# EAGLE design ProjectorController (EAGLE 9.6.1)
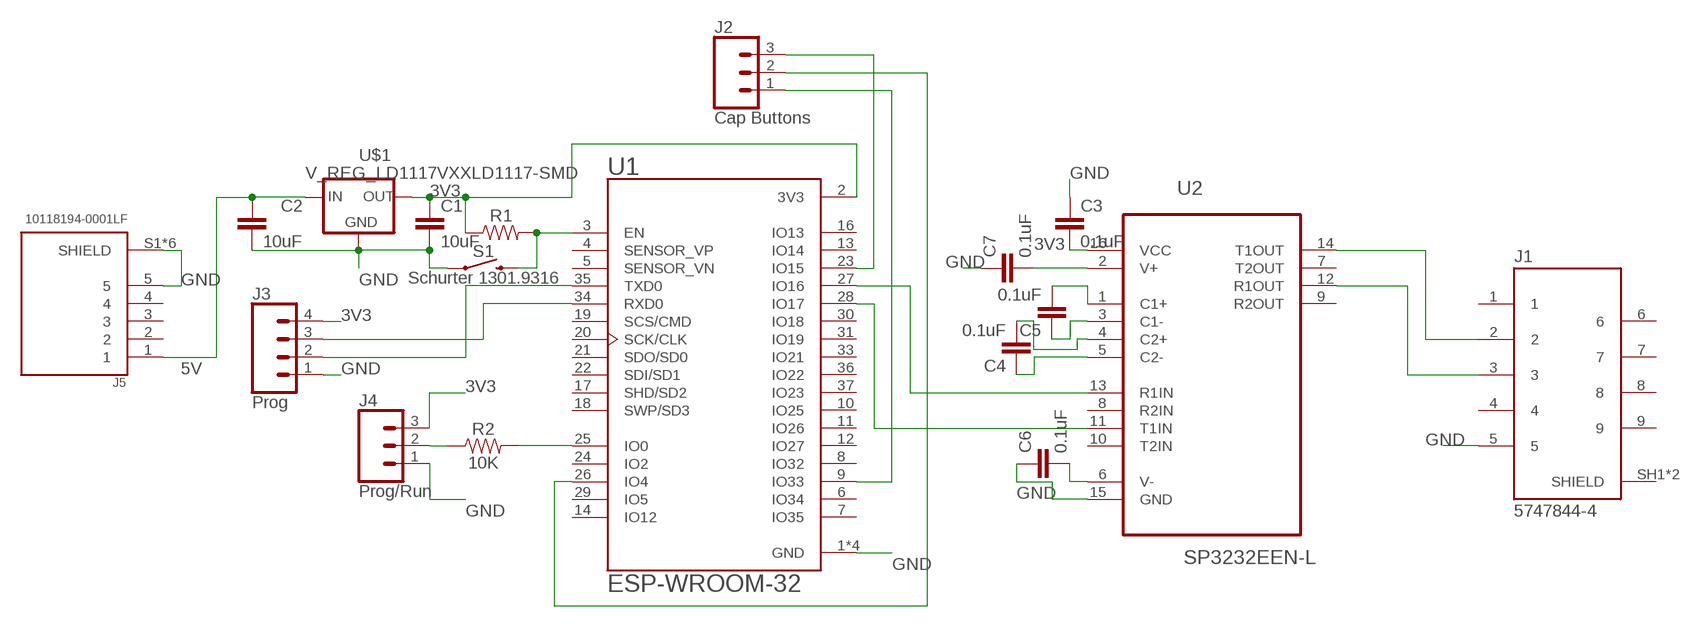
[diagram p0: schematic, sheet 1]

## Parts
C1  10uF  CAP-1206  [1206]
C2  10uF  CAP-1206  [1206]
C3  0.1uF  CAP-1206  [1206]
C4  0.1uF  CAP-1206  [1206]
C5  0.1uF  CAP-1206  [1206]
C6  0.1uF  CAP-1206  [1206]
C7  0.1uF  CAP-1206  [1206]
J1  5747844-4  [TE_5747844-4]
J2  Cap Buttons  CONN_03SCREW-NS  [SCREWTERMINAL-3.5MM-3-NS]
J3  Prog  CONN_04PTH  [1X04]
J4  Prog/Run  CONN_03  [1X03]
J5  10118194-0001LF  [AMPHENOL_10118194-0001LF]
R1  RESISTOR1206  [1206]
R2  10K  RESISTOR1206  [1206]
S1  Schurter 1301.9316  MOMENTARY-SWITCH-SPST-SMD-6.2MM-TALL  [TACTILE_SWITCH_SMD_6.2MM_TALL]
U1  ESP-WROOM-32  [MODULE_ESP-WROOM-32]
U2  SP3232EEN-L  [SOIC127P600X175-16N]
U$1  V_REG_LD1117VXXLD1117-SMD  [SOT223]

## Nets
3V3: C1.1 C3.2 J3.4 J4.3 R1.1 U1.2(3V3) U2.16(VCC) U$1.2(OUT)
5V: C2.1 J5.1 U$1.3(IN)
GND: C1.2 C2.2 C3.1 C6.1 C7.1 J1.5 J3.1 J4.1 J5.5 J5.S1(SHIELD) J5.S2(SHIELD) J5.S3(SHIELD) J5.S4(SHIELD) J5.S5(SHIELD) J5.S6(SHIELD) S1.A2 U1.1(GND) U1.1.1(GND) U1.15(GND) U1.38(GND) U2.15(GND) U$1.1(GND)
N$1: J2.3 U1.23(IO15)
N$2: J2.1 U1.9(IO33)
N$3: J2.2 U1.26(IO4)
N$4: R1.2 S1.B2 U1.3(EN)
N$5: R2.2 U1.25(IO0)
N$6: J4.2 R2.1
N$7: J3.2 U1.35(TXD0)
N$8: J3.3 U1.34(RXD0)
N$9: U1.28(IO17) U2.11(T1IN)
N$10: J1.2 U2.14(T1OUT)
N$11: J1.3 U2.12(R1OUT)
N$12: C5.2 U2.1(C1+)
N$13: U1.27(IO16) U2.13(R1IN)
N$14: C5.1 U2.3(C1-)
N$15: C4.2 U2.4(C2+)
N$16: C4.1 U2.5(C2-)
N$17: C7.2 U2.2(V+)
N$19: C6.2 U2.6(V-)
Unconnected: J1.1 J1.4 J1.6 J1.7 J1.8 J1.9 J1.SH1(SHIELD) J1.SH2(SHIELD) J5.2 J5.3 J5.4 U1.4(SENSOR_VP) U1.5(SENSOR_VN) U1.6(IO34) U1.7(IO35) U1.8(IO32) U1.10(IO25) U1.11(IO26) U1.12(IO27) U1.13(IO14) U1.14(IO12) U1.16(IO13) U1.17(SHD/SD2) U1.18(SWP/SD3) U1.19(SCS/CMD) U1.20(SCK/CLK) U1.21(SDO/SD0) U1.22(SDI/SD1) U1.24(IO2) U1.29(IO5) U1.30(IO18) U1.31(IO19) U1.33(IO21) U1.36(IO22) U1.37(IO23) U2.7(T2OUT) U2.8(R2IN) U2.9(R2OUT) U2.10(T2IN)

## Library data of the parts
C1-C7 = SparkFun-Capacitors:CAP
J1 = 5747844-4:5747844-4: CONN D-SUB RCPT 9POS R/A SOLDER; AVAILABILITY: Unavailable; CENTERLINE_PITCH: 2.74 mm[.108 in]; COMMENT: 5747844-4; DESCRIPTION: Connector D-Subminiature Receptacle 9 Position 2.74mm Solder Right Angle Through Hole 9 Terminal 1 Port Tray; EU_ROHS_COMPLIANCE: Compliant; MF: TE Connectivity; MP: 5747844-4; NUMBER_OF_POSITIONS: 9; PACKAGE: None; PRICE: None; PRODUCT_TYPE: Connector; TE_PURCHASE_URL: https://www.te.com/usa-en/product-5747844-4.html?te_bu=Cor&te_type=disp&te_campaign=seda_glo_cor-seda-global-disp-prtnr-fy19-seda-model-bom-cta_sma-317_1&elqCampaignId=32493
J2 = SparkFun-Connectors:CONN_03: Multi connection point. Often used as Generic Header-pin footprint for 0.1 inch spaced/style header connections On any of the 0.1 inch spaced packages, you can populate with these: Break Away Headers - Straight <https://www.sparkfun.com/products/116> (PRT-00116) Break Away Male Headers - Right Angle <https://www.sparkfun.com/products/553> (PRT-00553) Female Headers <https://www.sparkfun.com/products/115> (PRT-00115) Break Away Headers - Machine Pin <https://www.sparkfun.com/products/117> (PRT-00117) Break Away Female Headers - Swiss Machine Pin <https://www.sparkfun.com/products/743> (PRT-00743) Stackable Header - 3 Pin (Female, 0.1") <https://www.sparkfun.com/products/13875> (PRT-13875) For SCREWTERMINALS and SPRING TERMINALS visit here: Screw Terimnals on SparkFun.com <https://www.sparkfun.com/search/results?term=Screw+Terminals> (5mm/3.5mm/2.54mm spacing) This device is also useful as a general connection point to wire up your design to another part of your project. Our various solder wires solder well into these plated through hole pads. Hook-Up Wire - Assortment (Stranded, 22 AWG) <https://www.sparkfun.com/products/11375> (PRT-11375) Hook-Up Wire - Assortment (Solid Core, 22 AWG) <https://www.sparkfun.com/products/11367> (PRT-11367) View the entire wire category on our website here <https://www.sparkfun.com/categories/141> Special notes: Molex polarized connector foot print use with SKU : PRT-08232 with associated crimp pins and housings.
J3 = SparkFun-Connectors:CONN_04: Multi connection point. Often used as Generic Header-pin footprint for 0.1 inch spaced/style header connections On any of the 0.1 inch spaced packages, you can populate with these: Break Away Headers - Straight <https://www.sparkfun.com/products/116> (PRT-00116) Break Away Male Headers - Right Angle <https://www.sparkfun.com/products/553> (PRT-00553) Female Headers <https://www.sparkfun.com/products/115> (PRT-00115) Break Away Headers - Machine Pin <https://www.sparkfun.com/products/117> (PRT-00117) Break Away Female Headers - Swiss Machine Pin <https://www.sparkfun.com/products/743> (PRT-00743) For SCREWTERMINALS and SPRING TERMINALS visit here: Screw Terimnals on SparkFun.com <https://www.sparkfun.com/search/results?term=Screw+Terminals> (5mm/3.5mm/2.54mm spacing) This device is also useful as a general connection point to wire up your design to another part of your project. Our various solder wires solder well into these plated through hole pads. Hook-Up Wire - Assortment (Stranded, 22 AWG) <https://www.sparkfun.com/products/11375> (PRT-11375) Hook-Up Wire - Assortment (Solid Core, 22 AWG) <https://www.sparkfun.com/products/11367> (PRT-11367) View the entire wire category on our website here <https://www.sparkfun.com/categories/141> Special notes: Molex polarized connector foot print use with SKU : PRT-08231 with associated crimp pins and housings. 1MM SMD Version SKU: PRT-10208; PROD_ID: CONN-09696
J4 = SparkFun-Connectors:CONN_03: Multi connection point. Often used as Generic Header-pin footprint for 0.1 inch spaced/style header connections On any of the 0.1 inch spaced packages, you can populate with these: Break Away Headers - Straight <https://www.sparkfun.com/products/116> (PRT-00116) Break Away Male Headers - Right Angle <https://www.sparkfun.com/products/553> (PRT-00553) Female Headers <https://www.sparkfun.com/products/115> (PRT-00115) Break Away Headers - Machine Pin <https://www.sparkfun.com/products/117> (PRT-00117) Break Away Female Headers - Swiss Machine Pin <https://www.sparkfun.com/products/743> (PRT-00743) Stackable Header - 3 Pin (Female, 0.1") <https://www.sparkfun.com/products/13875> (PRT-13875) For SCREWTERMINALS and SPRING TERMINALS visit here: Screw Terimnals on SparkFun.com <https://www.sparkfun.com/search/results?term=Screw+Terminals> (5mm/3.5mm/2.54mm spacing) This device is also useful as a general connection point to wire up your design to another part of your project. Our various solder wires solder well into these plated through hole pads. Hook-Up Wire - Assortment (Stranded, 22 AWG) <https://www.sparkfun.com/products/11375> (PRT-11375) Hook-Up Wire - Assortment (Solid Core, 22 AWG) <https://www.sparkfun.com/products/11367> (PRT-11367) View the entire wire category on our website here <https://www.sparkfun.com/categories/141> Special notes: Molex polarized connector foot print use with SKU : PRT-08232 with associated crimp pins and housings.; PROD_ID: XXX-00000; VALUE: 455-1750-1-ND
J5 = 10118194-0001LF:10118194-0001LF: Micro Usb, 2.0 Type b, Rcpt, Smt; AVAILABILITY: Unavailable; DESCRIPTION: USB - micro B USB 2.0 Receptacle Connector 5 Position Surface Mount, Right Angle; Through Hole; MF: Amphenol ICC; MP: 10118194-0001LF; PACKAGE: None; PRICE: None
R1 R2 = SparkFun-Resistors:RESISTOR: Generic Resistor Package
S1 = SparkFun-Switches:MOMENTARY-SWITCH-SPST: Momentary Switch (Pushbutton) - SPST Normally-open (NO) SPST momentary switches (buttons, pushbuttons). Variants PTH-12MM - 12mm square, through-hole Momentary Pushbutton Switch - 12mm Square <https://www.sparkfun.com/products/9190> (COM-09190) PTH-6.0MM, PTH-6.0MM-KIT - 6.0mm square, through-hole Mini Pushbutton Switch <https://www.sparkfun.com/products/97> (COM-00097) KIT package intended for soldering kit's - only one side of pads' copper is exposed. PTH-RIGHT-ANGLE-KIT - Right-angle, through-hole Right Angle Tactile Button <https://www.sparkfun.com/products/10791> - Used on SparkFun BigTime Watch Kit <https://www.sparkfun.com/products/11734> SMD-12MM - 12mm square, surface-mount Tactile Button - SMD (12mm) <https://www.sparkfun.com/products/12993> (COM-12993) Used on SparkFun PicoBoard <https://www.sparkfun.com/products/11888> SMD-4.5MM - 4.5mm Square Trackball Switch Used on SparkFun Blackberry Trackballer Breakout <https://www.sparkfun.com/products/13169> SMD-4.6MMX2.8MM - 4.60mm x 2.80mm, surface mount Used on SparkFun SAMD21 Mini Breakout <https://www.sparkfun.com/products/13664> SMD-5.2MM, SMD-5.2-REDUNDANT - 5.2mm square, surface-mount Mini Pushbutton Switch - SMD <https://www.sparkfun.com/products/8720> (COM-08720) Used on Arduino Pro Mini <https://www.sparkfun.com/products/11114> REDUNDANT package connects both switch circuits together SMD-6.0X3.5MM - 6.0 x 3.5mm, surface mount Momentary Reset Switch SMD <https://www.sparkfun.com/products/8229> (COM-08229) SMD-6.2MM-TALL - 6.2mm square, surface mount Tactile Button - SMD (6mm) <https://www.sparkfun.com/products/12992> Used on SparkFun Digital Sandbox <https://www.sparkfun.com/products/12651> SMD-RIGHT-ANGLE - Right-angle, surface mount Used on SparkFun Block for Intel® Edison - Arduino <https://www.sparkfun.com/products/13036>; PROD_ID: SWCH-11966; SF_SKU: COM-12992
U1 = ESP-WROOM-32:ESP-WROOM-32: Module: combo; GPIO, I2C x2, I2S x2, SDIO, SPI x3, UART x3; 19.5dBm; AVAILABILITY: Unavailable; DESCRIPTION: WiFi 802.11b/g/n/d/e/i Transceiver Module 2.4GHz Surface Mount; MF: Olimex LTD; MP: ESP-WROOM-32; PACKAGE: Module Olimex LTD; PRICE: None
U2 = SP3232EEN-L:SP3232EEN-L: RS-232 Transceivers; AVAILABILITY: Unavailable; DESCRIPTION: SP3232E Series 120 kbps 5.5 V True RS-232 Transceiver - NSOIC-16; MF: MaxLinear, Inc.; MP: SP3232EEN-L/TR; PACKAGE: SOIC-16 Exar; PRICE: None
U$1 = SparkFun-IC-Power:V_REG_LD1117VXX: LD1117VXX voltage regulator. We carry the 3.3V version (COM-00526) in TO-220 package.; PROD_ID: VREG-13917

## Board
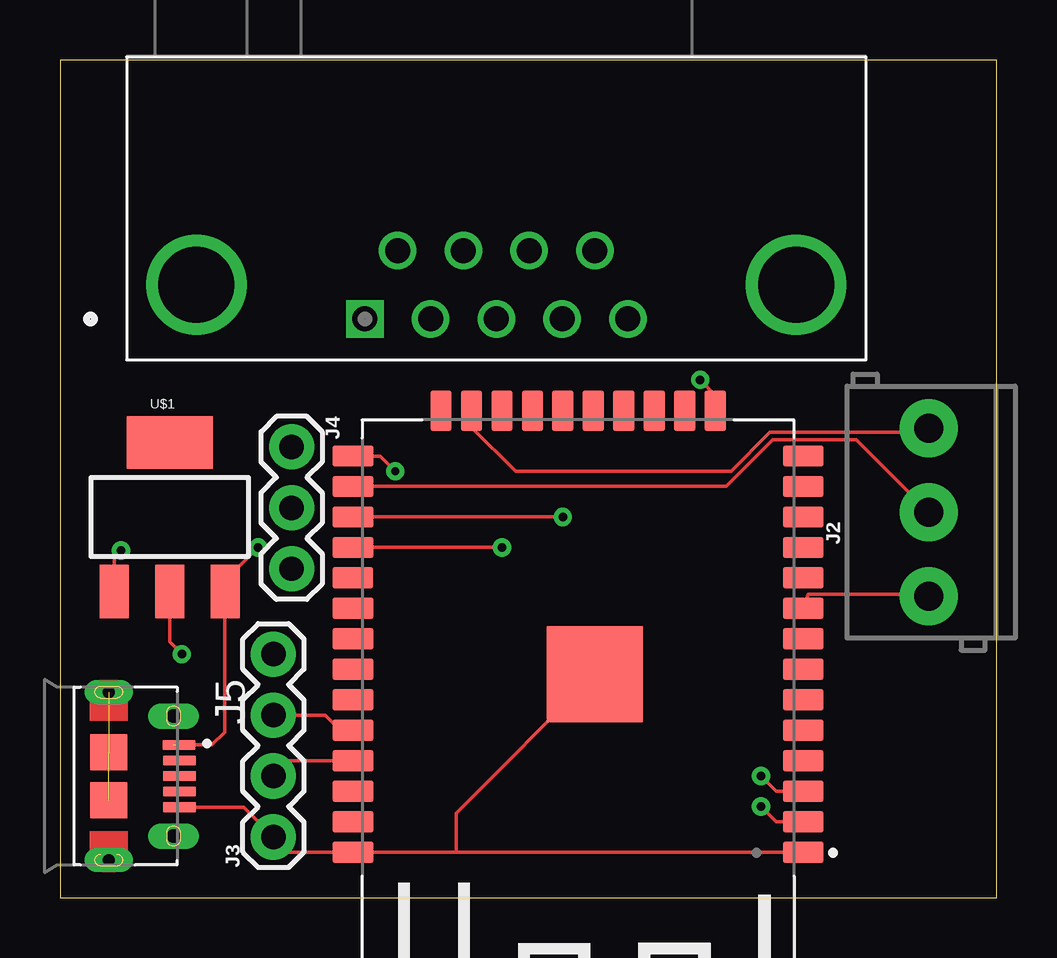
[diagram p1: board, top side]
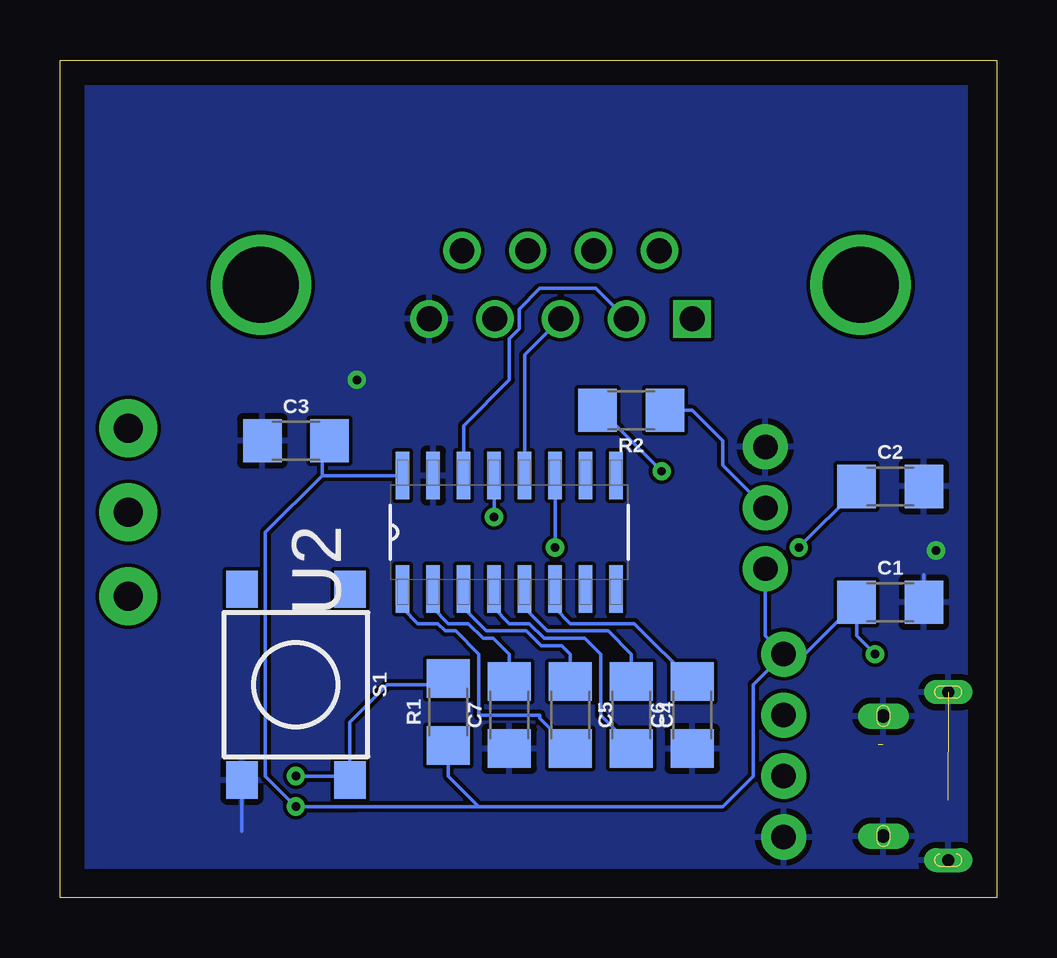
[diagram p2: board, bottom side, seen from below]

Size 39.04 x 34.91 mm. Coordinates in mm from the lower left corner, seen from the top.
Outline: 0,0 39.04,0 39.04,34.91 0,34.91 0,0
Copper layers (1*16): Top 0.035mm / dielectric 1.5mm / Bottom 0.035mm
Design rules "default": minimum track width 6mil, minimum drill 0.35mm, track to track 6mil, track to pad 6mil, pad to pad 6mil, via to via 6mil, smd to smd 6mil, copper to edge 40mil, drill to drill 6mil, minimum pad ring 10mil, minimum via ring 8mil, stop-mask expansion 4mil, vias tented up to drill 0mil, thermal gap 10mil

### Footprints (pad centres in the part's own frame; a part is rotated, then mirrored left to right if it is on the bottom)
1206 = smd 1.6 x 1.8: 1 -1.4,0; 2 1.4,0
TE_5747844-4 = drill 1.04 square: 1 0,0 | drill 1.04: 2 2.74,0; 3 5.48,0; 4 8.22,0; 5 10.96,0; 6 1.37,2.84; 7 4.11,2.84; 8 6.85,2.84; 9 9.59,2.84 | drill 3.17: SH1 -7.02,1.42; SH2 17.97,1.42
SCREWTERMINAL-3.5MM-3-NS = drill 1.2 pad 2.413: 1 0,0; 2 3.5,0; 3 7,0
1X04 = drill 1.016 pad 1.88: 1 0,0; 2 2.54,0; 3 5.08,0; 4 7.62,0
1X03 = drill 1.016 pad 1.88: 1 0,0; 2 2.54,0; 3 5.08,0
AMPHENOL_10118194-0001LF = smd 0.4 x 1.35: 1 -1.3,2.921; 2 -0.65,2.954; 3 0,2.954; 4 0.65,2.954; 5 1.3,2.954 | drill 0.55 pad 0.65 long: S1 -2.5,2.7; S2 2.5,2.7 | drill 0.5 pad 0.775 long: S3 -3.5,0; S6 3.5,0 | smd 1.5 x 1.55: S4 -1,0; S5 1,0
TACTILE_SWITCH_SMD_6.2MM_TALL = smd 1.55 x 1.3: A1 -3.975,-2.25; A2 3.975,-2.25; B1 -3.975,2.25; B2 3.975,2.25
MODULE_ESP-WROOM-32 = smd 1.7 x 0.9: 1 -9.381,8.255; 2 -9.381,6.985; 3 -9.381,5.715; 4 -9.381,4.445; 5 -9.381,3.175; 6 -9.381,1.905; 7 -9.381,0.635; 8 -9.381,-0.635; 9 -9.381,-1.905; 10 -9.381,-3.175; 11 -9.381,-4.445; 12 -9.381,-5.715; 13 -9.381,-6.985; 14 -9.381,-8.255; 25 9.381,-8.255; 26 9.381,-6.985; 27 9.381,-5.715; 28 9.381,-4.445; 29 9.398,-3.175; 30 9.381,-1.905; 31 9.381,-0.635; 32 9.381,0.635; 33 9.381,1.905; 34 9.381,3.175; 35 9.381,4.445; 36 9.381,5.715; 37 9.381,6.985; 38 9.381,8.255 | smd 4 x 4: 1.1 -0.7,0.845 | smd 0.9 x 1.7: 15 -5.715,-10.136; 16 -4.445,-10.136; 17 -3.175,-10.136; 18 -1.905,-10.136; 19 -0.635,-10.136; 20 0.635,-10.136; 21 1.905,-10.136; 22 3.175,-10.136; 23 4.445,-10.136; 24 5.715,-10.136
SOIC127P600X175-16N = smd 1.981 x 0.559: 1 -2.362,4.445; 2 -2.362,3.175; 3 -2.362,1.905; 4 -2.362,0.635; 5 -2.362,-0.635; 6 -2.362,-1.905; 7 -2.362,-3.175; 8 -2.362,-4.445; 9 2.362,-4.445; 10 2.362,-3.175; 11 2.362,-1.905; 12 2.362,-0.635; 13 2.362,0.635; 14 2.362,1.905; 15 2.362,3.175; 16 2.362,4.445
SOT223 = smd 1.219 x 2.235: 1 -2.311,-3.099; 2 0,-3.099; 3 2.311,-3.099 | smd 3.6 x 2.2: 4 0,3.099

### Placement (x,y rotation side)
C1  4.45,12.32 0 bottom
C2  4.45,17.15 0 bottom
C3  29.21,19.05 0 bottom
C4  15.24,7.62 270 bottom
C5  17.78,7.62 270 bottom
C6  12.7,7.62 90 bottom
C7  20.32,7.62 90 bottom
J1  12.7,24.13 0 top
J2  36.2,12.57 90 top
J3  8.89,2.54 90 top
J4  9.65,18.8 270 top
J5  2.03,5.08 270 top
R1  22.86,7.75 90 bottom
R2  15.24,20.32 180 bottom
S1  29.21,8.89 270 bottom
U1  21.59,10.16 180 top
U2  20.32,15.24 90 bottom
U$1  4.57,15.88 0 top

### Tracks (layer width: path | path; a pad name or v marks a point on that pad's centre or on a via)
3V3  (via drill 0.35)
  Top 0.152: v29.21,3.81 29.85,3.17 U1.2 | U$1.2 4.57,10.67 v5.08,10.16
  Bottom 0.152: J3.4 8,10.16 C1.1 5.84,10.92 v5.08,10.16 | U2.16 28.12,17.6 | 28.12,17.6 30.48,15.24 30.48,5.08 v29.21,3.81 26.67,3.81 21.59,3.81 | J4.3 9.65,10.92 J3.4 | 21.59,3.81 22.86,5.08 R1.1 | C3.2 28.12,18.74 28.12,17.6 | J3.4 10.16,8.89 10.16,5.08 11.43,3.81 21.59,3.81
5V  (via drill 0.35)  (1 unrouted)
  Top 0.152: v8.25,14.6 6.88,13.23 U$1.3 6.85,12.75 6.85,6.91 6.32,6.38 4.73,6.38
  Bottom 0.152: C2.1 5.84,17.02 v8.25,14.6
GND  (via drill 0.35)  (2 unrouted)
  Top 0.152: 5.36,3.78 J5.5 7.65,3.78 J3.1 9.53,1.91 U1.38 16.51,1.91 | 2.32,12.84 U$1.1 2.26,14.2 v2.54,14.48 | 16.51,1.91 U1.1 | U1.1.1 16.51,3.54 16.51,1.91 | J4.1 | v26.67,21.59 27.3,20.96 U1.15
  Bottom 0.152: 3.05,13.46 C1.2 | S1.A2 31.46,2.77
  pour Bottom: 1.27,34.29 1.27,1.27 38.1,1.27 38.1,34.29
N$1
  Top 0.152: J2.3 36.02,19.4 29.58,19.4 27.96,17.78 18.99,17.78 17.14,19.62 U1.23
N$2
  Top 0.152: U1.9 31.18,12.66 36.11,12.66 J2.1
N$3
  Top 0.152: U1.26 27.76,17.15 29.7,19.09 33.17,19.09 J2.2
N$4  (via drill 0.35)
  Top 0.152: U1.3 29.85,4.45 v29.21,5.08
  Bottom 0.152: v29.21,5.08 27.12,5.08 S1.B2 26.96,7.33 25.4,8.89 23.12,8.89 R1.2
N$5  (via drill 0.35)
  Top 0.152: U1.25 13.33,18.41 v13.97,17.78
  Bottom 0.152: v13.97,17.78 16.51,20.32 R2.2
N$6
  Bottom 0.152: R2.1 12.7,20.32 11.43,19.05 11.43,18.03 J4.2
N$7
  Top 0.152: J3.2 9.53,5.72 U1.35
N$8
  Top 0.152: J3.3 11.05,7.62 11.68,6.98 U1.34
N$9  (via drill 0.35)
  Top 0.152: U1.28 v18.42,14.6
  Bottom 0.152: U2.11 v18.42,14.6
N$10
  Bottom 0.152: U2.14 22.23,19.69 20.32,21.59 20.32,23.3 19.91,23.71 19.91,24.54 19.05,25.4 16.71,25.4 J1.2
N$11
  Bottom 0.152: U2.12 19.69,22.63 J1.3
N$12
  Bottom 0.152: C5.2 19.05,7.49 19.05,7.62 21.59,7.62 21.59,10.16 22.55,11.12 22.99,11.12 23.29,11.43 24.13,11.43 24.77,12.06 U2.1
N$13  (via drill 0.35)
  Top 0.152: U1.27 v20.96,15.88
  Bottom 0.152: U2.13 v20.96,15.88
N$14
  Bottom 0.152: C5.1 17.78,10.16 18.14,10.52 19,10.52 19.61,11.12 21.29,11.12 22.23,12.06 U2.3
N$15
  Bottom 0.152: U2.4 20.96,12.7 20.96,12.06 20.32,11.43 19.48,11.43 18.87,10.82 17.17,10.82 16.51,10.16 16.51,7.62 15.24,6.35 C4.2
N$16
  Bottom 0.152: U2.5 19.69,12.7 19.69,12.06 18.75,11.12 16.21,11.12 15.24,10.16 C4.1
N$17
  Bottom 0.152: U2.2 23.5,12.06 22.86,11.43 22.02,11.43 21.41,10.82 20.98,10.82 20.32,10.16 C7.2
N$19
  Bottom 0.152: C6.2 15.11,11.43 17.78,11.43 18.42,12.06 U2.6